# Altium schematic sheet NEOPIXELS.SchDoc
size A4; SheetNumber: 3; SheetTotal: 6
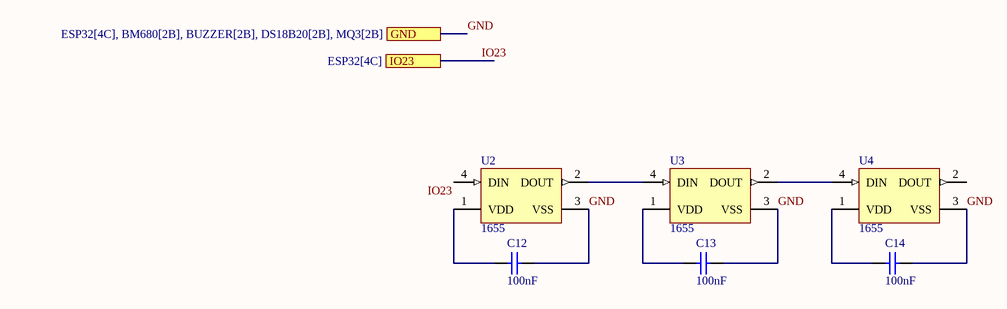
[diagram p0: NEOPIXELS.SchDoc]

## Parts
C12  100nF  [CAPC2013X140X50ML20T25]
C13  100nF  [CAPC2013X140X50ML20T25]
C14  100nF  [CAPC2013X140X50ML20T25]
U2  1655  [ADA-RGB-1655_V]
U3  1655  [ADA-RGB-1655_V]
U4  1655  [ADA-RGB-1655_V]

## Ports
GND (see ESP32[4C], BM680[2B], BUZZER[2B], DS18B20[2B], MQ3[2B]), IO23 (see ESP32[4C])

## Nets
GND: C12.1 C13.1 C14.1 U2.3(VSS) U3.3(VSS) U4.3(VSS) ; port GND
IO23: U2.4(DIN) ; port IO23
NetC12_2: C12.2 U2.1(VDD)
NetC13_2: C13.2 U3.1(VDD)
NetC14_2: C14.2 U4.1(VDD)
NetU2_2: U2.2(DOUT) U3.4(DIN)
NetU3_2: U3.2(DOUT) U4.4(DIN)

Not connected (* = marked no-connect by the designer): U4 2(DOUT)

## Library data of the parts
C12-C14 = CMP-2007-03242-1: 10µF ±10% 16V Ceramic Capacitor X5R 0805 (2012 Metric); Part Number: CL21A106KOQNNNG
U2-U4 = CMP-2000-05026-1: Intelligent Control LED Integrated Light Source, 3.5 to 5.3 V, -25 to 80 degC, 4-Pin SMD, RoHS, Tape and Reel; Manufacturer: Adafruit-Industries-LLC; Number of LEDs: 10; Configuration: Discrete; Utilized LED: WS2812(5050); Datasheet URL: http://datasheet.octopart.com/ADA1655-Adafruit-Industries-datasheet-32028139.pdf; Series: Neopixel; Interface: -; Package Description: 4-Pin Surface Mount Device, Body 5 x 5 mm; Color: Red,Green,Blue(RGB); Category: Optoelectronics; Controller Type: -; Package Reference: 1655; Manufacturer URL: https://www.adafruit.com/; Mounting Type: SurfaceMount; Datasheet Version: May-13; Size / Dimension: 5.00mmLx5.00mmW; Family: Addressable,Specialty